# EAGLE design APRS_Interface (EAGLE 7.7.0)
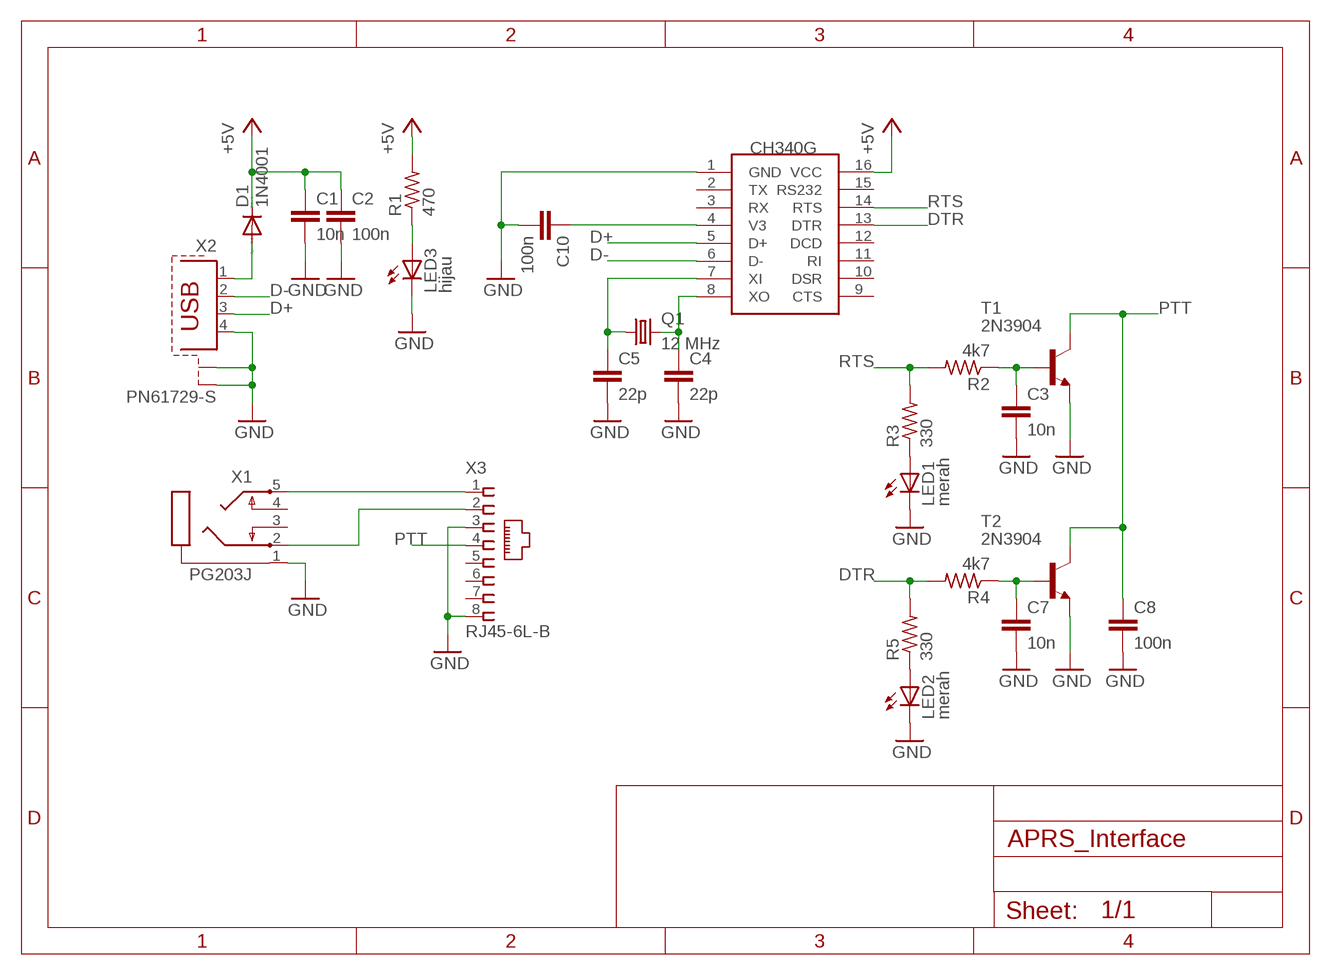
[diagram p0: schematic, sheet 1]

## Parts
C1  10n  C-EUC0805K  [C0805K]
C2  100n  C-EUC0805K  [C0805K]
C3  10n  C-EUC0805K  [C0805K]
C4  22p  C-EUC0805K  [C0805K]
C5  22p  C-EUC0805K  [C0805K]
C7  10n  C-EUC0805K  [C0805K]
C8  100n  C-EUC0805K  [C0805K]
C10  100n  C-EUC0805K  [C0805K]
D1  1N4001  1N4148DO35-7  [DO35-7]
LED1  merah  LED3MM  [LED3MM]
LED2  merah  LED3MM  [LED3MM]
LED3  hijau  LED3MM  [LED3MM]
Q1  12 MHz  CRYSTALHC49S  [HC49/S]
R1  470  R-US_R0805  [R0805]
R2  4k7  R-US_R0805  [R0805]
R3  330  R-US_R0805  [R0805]
R4  4k7  R-US_R0805  [R0805]
R5  330  R-US_R0805  [R0805]
T1  2N3904  2N3904-NPN-TO92-EBC  [TO92-EBC]
T2  2N3904  2N3904-NPN-TO92-EBC  [TO92-EBC]
U$1  CH340G  [SOIC16]
X1  PG203J  [PG203J]
X2  PN61729-S  [PN61729-S]
X3  RJ45-6L-B  [RJ45-NO-SHIELD]

## Nets
+5V: C1.1 C2.1 D1.C R1.2 U$1.16(VCC)
D+: U$1.5(D+) X2.3
D-: U$1.6(D-) X2.2
DTR: R4.2 R5.2 U$1.13(DTR)
GND: C1.2 C2.2 C3.2 C4.2 C5.2 C7.2 C8.2 C10.2 LED1.K(C) LED2.K(C) LED3.K(C) T1.E T2.E U$1.1(GND) X1.1 X2.4 X2.S1 X2.S2 X3.3 X3.8
N$1: D1.A X2.1
N$2: C4.1 Q1.2 U$1.8(XO)
N$3: C5.1 Q1.1 U$1.7(XI)
N$4: C10.1 U$1.4(V3)
N$5: C3.1 R2.1 T1.B
N$6: X1.5 X3.1
N$7: LED1.A R3.1
N$8: X1.2 X3.2
N$9: C7.1 R4.1 T2.B
N$10: LED3.A R1.1
N$12: LED2.A R5.1
PTT: C8.1 T1.C T2.C X3.4
RTS: R2.2 R3.2 U$1.14(RTS)
Unconnected: U$1.2(TX) U$1.3(RX) U$1.9(CTS) U$1.10(DSR) U$1.11(RI) U$1.12(DCD) U$1.15(RS232) X1.3 X1.4 X3.5 X3.6 X3.7

## Library data of the parts
C1-C5 C7 C8 C10 = rcl:C-EU: CAPACITOR, European symbol
D1 = diode:1N4148: DIODE high speed (Philips)
LED1-LED3 = led:LED: LED OSRAM: - CHIPLED LG R971, LG N971, LY N971, LG Q971, LY Q971, LO R971, LY R971 LH N974, LH R974 LS Q976, LO Q976, LY Q976 LO Q996 - Hyper CHIPLED LW Q18S LB Q993, LB Q99A, LB R99A - SideLED LS A670, LO A670, LY A670, LG A670, LP A670 LB A673, LV A673, LT A673, LW A673 LH A674 LY A675 LS A676, LA A676, LO A676, LY A676, LW A676 LS A679, LY A679, LG A679 - Hyper Micro SIDELED® LS Y876, LA Y876, LO Y876, LY Y876 LT Y87S - SmartLED LW L88C, LW L88S LB L89C, LB L89S, LG L890 LS L89K, LO L89K, LY L89K LS L896, LA L896, LO L896, LY L896 - TOPLED LS T670, LO T670, LY T670, LG T670, LP T670 LSG T670, LSP T670, LSY T670, LOP T670, LYG T670 LG T671, LOG T671, LSG T671 LB T673, LV T673, LT T673, LW T673 LH T674 LS T676, LA T676, LO T676, LY T676, LB T676, LH T676, LSB T676, LW T676 LB T67C, LV T67C, LT T67C, LS T67K, LO T67K, LY T67K, LW E67C LS E67B, LA E67B, LO E67B, LY E67B, LB E67C, LV E67C, LT E67C LW T67C LS T679, LY T679, LG T679 LS T770, LO T770, LY T770, LG T770, LP T770 LB T773, LV T773, LT T773, LW T773 LH T774 LS E675, LA E675, LY E675, LS T675 LS T776, LA T776, LO T776, LY T776, LB T776 LHGB T686 LT T68C, LB T68C - Hyper Mini TOPLED® LB M676 - Mini TOPLED Santana® LG M470 LS M47K, LO M47K, LY M47K Source: http://www.osram.convergy.de LUXEON: - LUMILED® LXK2-PW12-R00, LXK2-PW12-S00, LXK2-PW14-U00, LXK2-PW14-V00 LXK2-PM12-R00, LXK2-PM12-S00, LXK2-PM14-U00 LXK2-PE12-Q00, LXK2-PE12-R00, LXK2-PE12-S00, LXK2-PE14-T00, LXK2-PE14-U00 LXK2-PB12-K00, LXK2-PB12-L00, LXK2-PB12-M00, LXK2-PB14-N00, LXK2-PB14-P00, LXK2-PB14-Q00 LXK2-PR12-L00, LXK2-PR12-M00, LXK2-PR14-Q00, LXK2-PR14-R00 LXK2-PD12-Q00, LXK2-PD12-R00, LXK2-PD12-S00 LXK2-PH12-R00, LXK2-PH12-S00 LXK2-PL12-P00, LXK2-PL12-Q00, LXK2-PL12-R00 Source: www.luxeon.com KINGBRIGHT: KA-3528ASYC Source: www.kingbright.com
Q1 = crystal:CRYSTAL: CRYSTAL; OC_FARNELL: 1667008; OC_NEWARK: unknown
R1-R5 = rcl:R-US_: RESISTOR, American symbol
T1 T2 = transistor-neu-to92:*-NPN-: NPN Transistror
U$1 = ch340g:CH340G
X1 = con-hirschmann:PG203J: MIC/HEADPHONE JACK KS-S stereo microphone/headphone jack PG203JN (Schukat); OC_FARNELL: unknown; OC_NEWARK: unknown
X2 = con-berg:PN61729-S: BERG USB connector; OC_FARNELL: unknown; OC_NEWARK: unknown
X3 = con-tycoelectronics:RJ45: CORCOM Modular RJ Jacks No Shield Source: www.tycoelectronics.com .. ENG_DS_1654001_1099_RJ_L_0507.pdf; MPN: RJ45-6L-B; OC_FARNELL: unknown; OC_NEWARK: 16R6090

## Board
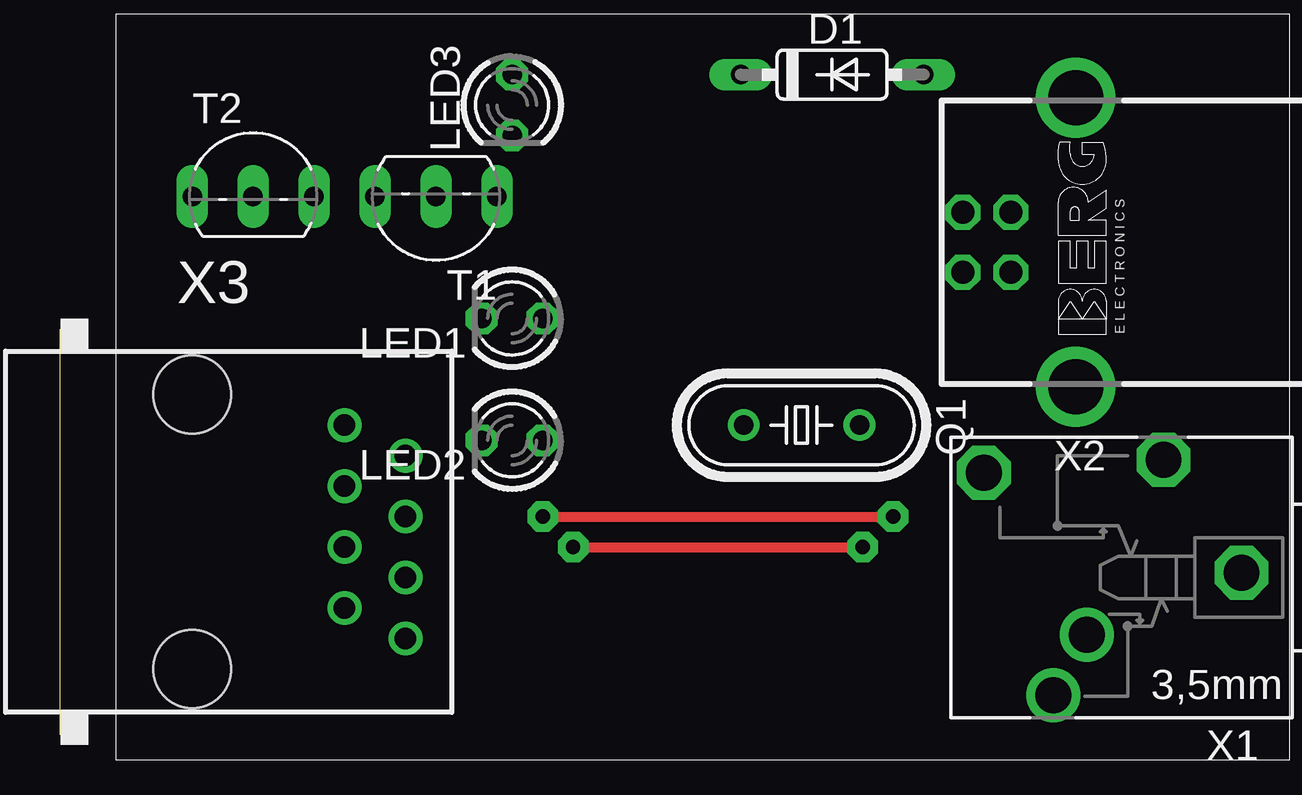
[diagram p1: board, top side]
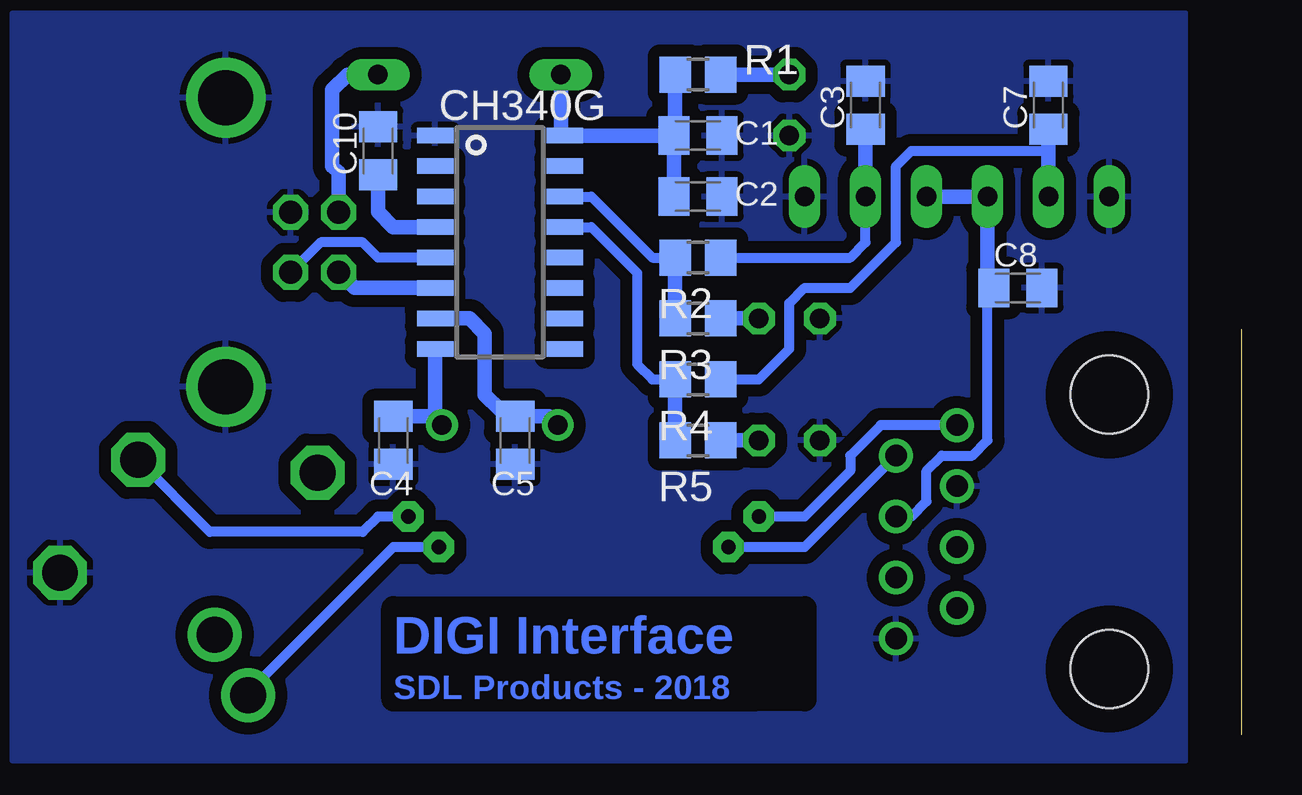
[diagram p2: board, bottom side, seen from below]

Size 0 x 16.89 mm. Coordinates in mm from the lower left corner, seen from the top.
Copper layers (1*16): Top 0.035mm / dielectric 1.5mm / Bottom 0.035mm
Design rules "default": minimum track width 10mil, minimum drill 24mil, track to track 8mil, track to pad 8mil, pad to pad 8mil, via to via 8mil, smd to smd 8mil, copper to edge 40mil, drill to drill 8mil, minimum pad ring 10mil, minimum via ring 8mil, stop-mask expansion 4mil, vias tented up to drill 0mil, thermal gap 10mil
bRestrict: area 18.2,1.5 to 35.4,5.3

### Footprints (pad centres in the part's own frame; a part is rotated, then mirrored left to right if it is on the bottom)
C0805K = smd 1.3 x 1.6: 1 -1,0; 2 1,0
DO35-7 = drill 0.813 long: A 3.81,0; C -3.81,0
LED3MM = drill 0.813 octagon: A -1.27,0; K 1.27,0
HC49/S = drill 0.813: 1 -2.413,0; 2 2.413,0
R0805 = smd 1.3 x 1.5: 1 -0.95,0; 2 0.95,0
TO92-EBC = drill 0.813 long: B 0,-1.27; C 2.54,-1.27; E -2.54,-1.27
SOIC16 = smd 0.635 x 1.524: 1 -4.445,-2.695; 2 -3.175,-2.695; 3 -1.905,-2.695; 4 -0.635,-2.695; 5 0.635,-2.695; 6 1.905,-2.695; 7 3.175,-2.695; 8 4.445,-2.695; 9 4.445,2.695; 10 3.175,2.695; 11 1.905,2.695; 12 0.635,2.695; 13 -0.635,2.695; 14 -1.905,2.695; 15 -3.175,2.695; 16 -4.445,2.695
PG203J = drill 1.499 octagon: 1 -5.004,-0.203; 4 5.74,-4.369; 5 -1.753,-4.902 | drill 1.499: 2 2.845,4.902; 3 1.448,2.388
PN61729-S = drill 0.95 octagon: 1 1.25,4.71; 2 -1.25,4.71; 3 -1.25,2.71; 4 1.25,2.71 | drill 2.3 pad 2.9: S1 -6.02,0; S2 6.02,0
RJ45-NO-SHIELD = drill 0.9 pad 1.4: 1 -4.445,6.35; 2 -3.175,8.89; 3 -1.905,6.35; 4 -0.635,8.89; 5 0.635,6.35; 6 1.905,8.89; 7 3.175,6.35; 8 4.445,8.89 | hole 3.251: -5.715,0; 5.715,0

### Placement (x,y rotation side)
C1  22.66,24.96 0 bottom  (outside the outline)
C2  22.66,22.42 0 bottom  (outside the outline)
C3  15.67,26.23 90 bottom  (outside the outline)
C4  35.36,12.26 270 bottom  (outside the outline)
C5  30.28,12.26 270 bottom  (outside the outline)
C7  8.05,26.23 90 bottom  (outside the outline)
C8  9.32,18.61 0 bottom  (outside the outline)
C10  35.99,24.32 90 bottom  (outside the outline)
D1  32.18,27.5 0 top  (outside the outline)
LED1  18.85,17.34 180 top  (outside the outline)
LED2  18.85,12.26 180 top  (outside the outline)
LED3  18.85,26.23 270 top  (outside the outline)
Q1  30.91,12.89 0 top  (outside the outline)
R1  22.66,27.5 180 bottom  (outside the outline)
R2  22.66,19.88 180 bottom  (outside the outline)
R3  22.66,17.34 180 bottom  (outside the outline)
R4  22.66,14.8 180 bottom  (outside the outline)
R5  22.66,12.26 180 bottom  (outside the outline)
T1  15.67,21.15 180 top  (outside the outline)
T2  8.05,23.69 0 top  (outside the outline)
U$1  30.91,20.51 270 bottom  (outside the outline)
X1  44.25,6.54 180 top  (outside the outline)
X2  42.34,20.51 90 top  (outside the outline)
X3  5.51,8.45 270 top  (outside the outline)

### Tracks (layer width: path | path; a pad name or v marks a point on that pad's centre or on a via)
+5V
  Bottom 0.61: D1.C 28.37,25.11 U$1.16 C1.1 | R1.2 23.61,25.01 C1.1 | C1.1 C2.1
D+
  Bottom 0.406: U$1.5 35.99,19.88 36.63,20.51 38.38,20.51 X2.3
D-
  Bottom 0.61: U$1.6 36.98,18.61 X2.2
DTR
  Bottom 0.406: U$1.13 27.1,21.15 25.2,19.24 25.2,15.43 24.56,14.8 R4.2
  Bottom 0.61: R4.2 R5.2
GND
  pour Bottom (isolate 0.5): 2.34,30.04 51.23,30.04 51.23,-1.08 2.34,-1.08
N$1
  Bottom 0.61: X2.1 37.63,23.42 37.9,23.69 37.9,26.86 37.26,27.5 D1.A
N$2
  Bottom 0.61: U$1.8 33.61,13.17 Q1.2 33.69,13.26 C4.1
N$3
  Bottom 0.61: U$1.7 32.18,17.34 31.55,16.7 31.55,14.16 30.91,13.53 30.55,13.53 C5.1 28.86,13.26 Q1.1
N$4
  Bottom 0.61: C10.1 35.99,21.78 35.36,21.15 U$1.4
N$5
  Bottom 0.406: R2.1 16.31,19.88 15.67,20.51 T1.B
  Bottom 0.61: C3.1 T1.B
N$6  (via drill 0.6 pad 1.27)
  Top 0.406: v20.12,9.08 v34.72,9.08
  Bottom 0.406: X3.1 15.04,12.89 16.31,11.62 16.31,10.99 18.21,9.08 v20.12,9.08 | v34.72,9.08 35.99,9.08 36.63,8.45 43,8.45 X1.5
N$7
  Bottom 0.61: R3.1 LED1.A
N$8  (via drill 0.6 pad 1.27)
  Top 0.406: v21.39,7.81 v33.45,7.81
  Bottom 0.406: X3.2 18.21,7.81 v21.39,7.81 | v33.45,7.81 35.36,7.81 41.07,2.1 41.07,1.97 X1.2
N$9
  Bottom 0.406: R4.1 20.12,14.8 18.85,16.07 18.85,17.97 18.21,18.61 16.31,18.61 14.4,20.51 14.4,23.69 13.77,24.32 8.05,24.32
  Bottom 0.61: C7.1 8.05,24.32 T2.B
N$10
  Bottom 0.61: LED3.A R1.1
N$12
  Bottom 0.61: R5.1 LED2.A
PTT
  Bottom 0.406: X3.4 13.77,9.08 13.13,9.72 13.13,10.99 12.5,11.62 11.23,11.62 10.59,12.26 10.59,18.34 C8.1
  Bottom 0.61: T1.C T2.C 10.59,18.88 C8.1
RTS
  Bottom 0.406: U$1.14 27.1,22.42 24.56,19.88 R2.2
  Bottom 0.61: R2.2 R3.2
(copper drawn outside any net)
  shapes: Top area x2

### Text on the board
Bottom: DIGI Interface | SDL Products - 2018